# Altium schematic sheet PIC32MK.SchDoc
size B; DocumentNumber: 3; SheetNumber: 2; SheetTotal: 4
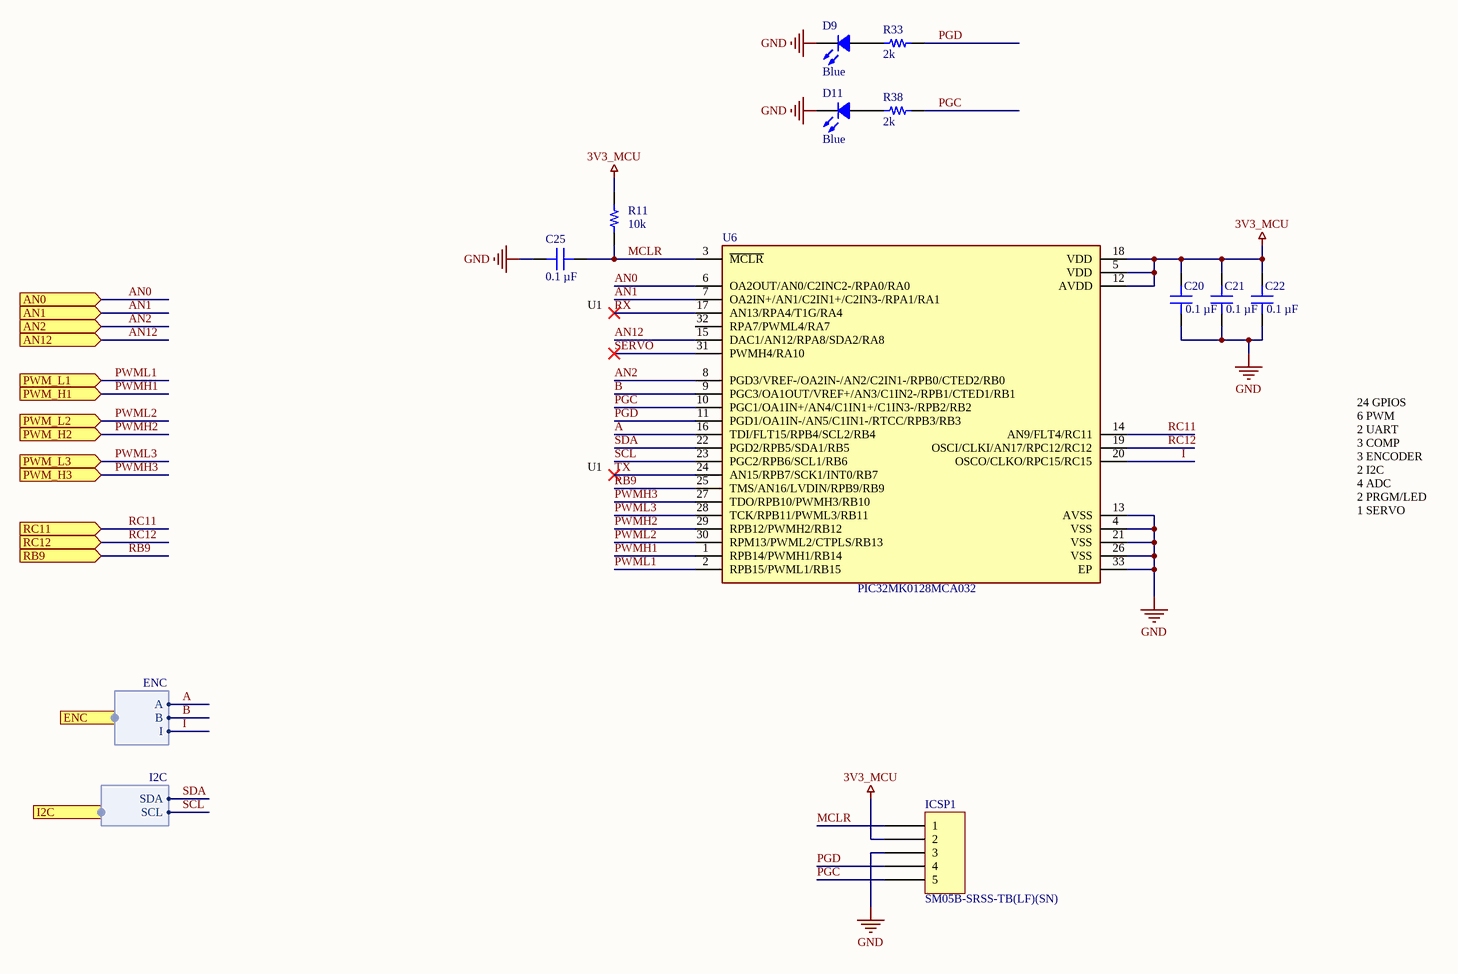
[diagram p0: PIC32MK.SchDoc]

## Parts
C20  0.1 µF  [CAP 0402_1005]
C21  0.1 µF  [CAP 0402_1005]
C22  0.1 µF  [CAP 0402_1005]
C25  0.1 µF  [CAP 0402_1005]
D9  Blue  [LED 0603_1608 GREEN]
D11  Blue  [LED 0603_1608 GREEN]
ICSP1  SM05B-SRSS-TB(LF)(SN)  [JST SM05B-SRSS-TB]
R11  10k  [RES 0402_1005]
R33  2k  [RES 0402_1005]
R38  2k  [RES 0402_1005]
U6  PIC32MK0128MCA032  [32-QFN_5x5_PIC32]

## Ports
AN0 (in), AN1 (in), AN2 (in), AN12 (in), ENC (harness ENC), I2C (harness I2C), PWM_H1 (in), PWM_H2 (in), PWM_H3 (in), PWM_L1 (in), PWM_L2 (in), PWM_L3 (in), RB9 (in), RC11 (in), RC12 (in)

## Harnesses
I2C: SDA, SCL
ENC: A, B, I

## Nets
3V3_MCU: C20.2 C21.2 C22.2 ICSP1.2 R11.2 U6.5(VDD) U6.12(AVDD) U6.18(VDD)
GND: C20.1 C21.1 C22.1 C25.2 D9.2 D11.2 ICSP1.3 U6.4(VSS) U6.13(AVSS) U6.21(VSS) U6.26(VSS) U6.33(EP)
A: U6.16(TDI/FLT15/RPB4/SCL2/RB4) ; port ENC.A
AN0: U6.6(OA2OUT/AN0/C2INC2-/RPA0/RA0) ; port AN0
AN1: U6.7(OA2IN+/AN1/C2IN1+/C2IN3-/RPA1/RA1) ; port AN1
AN2: U6.8(PGD3/VREF-/OA2IN-/AN2/C2IN1-/RPB0/CTED2/RB0) ; port AN2
AN12: U6.15(DAC1/AN12/RPA8/SDA2/RA8) ; port AN12
B: U6.9(PGC3/OA1OUT/VREF+/AN3/C1IN2-/RPB1/CTED1/RB1) ; port ENC.B
I: U6.20(OSCO/CLKO/RPC15/RC15) ; port ENC.I
MCLR: C25.1 ICSP1.1 R11.1 U6.3(~{MCLR})
PGC: ICSP1.5 R38.1 U6.10(PGC1/OA1IN+/AN4/C1IN1+/C1IN3-/RPB2/RB2)
PGD: ICSP1.4 R33.1 U6.11(PGD1/OA1IN-/AN5/C1IN1-/RTCC/RPB3/RB3)
PWMH1: U6.1(RPB14/PWMH1/RB14) ; port PWM_H1
PWMH2: U6.29(RPB12/PWMH2/RB12) ; port PWM_H2
PWMH3: U6.27(TDO/RPB10/PWMH3/RB10) ; port PWM_H3
PWML1: U6.2(RPB15/PWML1/RB15) ; port PWM_L1
PWML2: U6.30(RPM13/PWML2/CTPLS/RB13) ; port PWM_L2
PWML3: U6.28(TCK/RPB11/PWML3/RB11) ; port PWM_L3
RB9: U6.25(TMS/AN16/LVDIN/RPB9/RB9) ; port RB9
RC11: U6.14(AN9/FLT4/RC11) ; port RC11
RC12: U6.19(OSCI/CLKI/AN17/RPC12/RC12) ; port RC12
RX: U6.17(AN13/RPA4/T1G/RA4)
SCL: U6.23(PGC2/RPB6/SCL1/RB6) ; port I2C.SCL
SDA: U6.22(PGD2/RPB5/SDA1/RB5) ; port I2C.SDA
SERVO: U6.31(PWMH4/RA10)
TX: U6.24(AN15/RPB7/SCK1/INT0/RB7)
NetD9_1: D9.1 R33.2
NetD11_1: D11.1 R38.2

Not connected (* = marked no-connect by the designer): U6 32(RPA7/PWML4/RA7)

## Notes on the sheet
- (near C25) U1
- U1
- 24 GPIOS
  6 PWM
  2 UART
  3 COMP
  3 ENCODER
  2 I2C
  4 ADC
  2 PRGM/LED
  1 SERVO

## Library data of the parts
C20-C22 C25 = C0402C104K4RACAUTO: CAP CER 0.1UF 16V X7R 0402; manufacturer: KEMET; Tolerance: ±10%; Part Number: C0402C104K4RACAUTO; Value: 0.1 µF; Applications: Automotive, Bypass, Decoupling; Capacitance: 0.1 µF; componentlink1description: Datasheet; componentlink1url: https://api.kemet.com/component-edge/download/specsheet/C0402C104K4RACAUTO.pdf; componentlink2description: DigiKey Link; componentlink2url: https://www.digikey.com/en/products/detail/kemet/C0402C104K4RACAUTO/3314827; Device Package: 0402 (1005 Metric); lastupdated: 8/14/2022 9:05:51 PM; Lifecycle Status: Active; Minimum Order: 1; Mounting Type: Surface Mount, MLCC; Operating Temperature: -55°C ~ 125°C; Package / Case: 0402 (1005 Metric); packaging: TapeAndReel; partid: 3024; Part Status: Active; price: 0.01; Ratings: AEC-Q200; series: SMD Auto X7R; Size / Dimension: 0.039" L x 0.020" W (1.00mm x 0.50mm); Supplier 1: DigiKey; Supplier Part Number 1: 399-6828-1-ND; Temperature Coefficient: X7R; Thickness (Max): 0.022" (0.55mm); Voltage - Rated: 16V
D9 D11 = XZCDGK53W-8VF: Blue LED; Manufacturer: SunLED; Color: Green; Configuration: Independent; Current - Test: 2mA; Lens Color: Colorless; Lens Size: 0.35mm Dia; Lens Style: Round with Domed Top; Lens Transparency: Clear; Millicandela Rating: 417mcd; Value: Green; Viewing Angle: 60°; Voltage - Forward (Vf) (Typ): 2.65V; Wavelength - Dominant: 525nm; Wavelength - Peak: 515nm; Part Number: XZCDGK53W-8VF; ComponentLink1Description: Datasheet; ComponentLink1URL: https://www.sunledusa.com/products/spec/XZCDGK53W-8VF.pdf; ComponentLink2Description: DigiKey Link; ComponentLink2URL: http://digikey.com/product-detail/en/sunled/XZCDGK53W-8VF/1497-XZCDGK53W-8VFCT-ND/10449792; Device Package: 0603 (1608 Metric); Height (Max): 1.10mm; LastUpdated: 21-Jan-20 3:12:09 AM; Lifecycle Status: Active; Minimum Order: 1; Mounting Type: Surface Mount; Package / Case: 0603 (1608 Metric); Packaging: Unknown; PartId: 938; Part Status: Active; Price: 0.18; Series: Ultra Low Current; Size / Dimension: 1.60mm L x 0.80mm W; Supplier 1: DigiKey; Supplier Part Number 1: 1497-XZCDGK53W-8VFCT-ND; Supplier Device Package: 2-SMD
ICSP1 = SM05B-SRSS-TB(LF)(SN): CONN HEADER SMD R/A 5POS 1MM; Manufacturer: JST Sales America Inc.; Current Rating (Amps): 0.7A; Material Flammability Rating: UL94 V-0; Number of Positions: 5; Number of Positions Loaded: All; Pitch - Mating: 0.039" (1.00mm); Shrouding: Shrouded - 4 Wall; Style: Board to Cable/Wire; Voltage Rating: 50V; Part Number: SM05B-SRSS-TB(LF)(SN); ComponentLink1Description: Datasheet; ComponentLink1URL: http://www.jst-mfg.com/product/pdf/eng/eSH.pdf; ComponentLink2Description: DigiKey Link; ComponentLink2URL: http://digikey.com/product-detail/en/jst-sales-america-inc/SM05B-SRSS-TB-LF-SN/455-1805-1-ND/926876; Connector Type: Header; Contact Finish - Mating: Tin; Contact Finish - Post: Tin; Contact Material: Copper Alloy; Contact Shape: Square; Contact Type: Male Pin; Fastening Type: Push-Pull; Features: Solder Retention; Insulation Color: Natural; Insulation Height: 0.114" (2.90mm); Insulation Material: Polyamide (PA), Nylon; LastUpdated: 1/12/2020 11:42:04 PM; Lifecycle Status: Active; Minimum Order: 1; Mounting Type: Surface Mount, Right Angle; Number of Rows: 1; Operating Temperature: -25°C ~ 85°C; Packaging: TapeAndReel; PartId: 63; Part Status: Active; Price: 0.32; Series: SR; Supplier 1: DigiKey; Supplier Part Number 1: 455-1805-1-ND; Termination: Solder
R11 R33 R38 = RK73H1ETTP1432F: RES 14.3K OHM 1% 1/10W 0402; Manufacturer: KOA Speer Electronics, Inc.; Power (Watts): 0.1W, 1/10W; Resistance: 14.3 kOhms; Temperature Coefficient: ±100ppm/°C; Part Number: RK73H1ETTP1432F; ComponentLink1Description: Datasheet; ComponentLink1URL: http://www.koaspeer.com/catimages/Products/RK73H/RK73H.pdf; ComponentLink2Description: DigiKey Link; ComponentLink2URL: https://www.digikey.com/en/products/detail/koa-speer-electronics-inc/RK73H1ETTP1432F/9844351; Composition: Thick Film; Device Package: 0402 (1005 Metric); Features: Automotive AEC-Q200, Moisture Resistant; Height - Seated (Max): 0.016" (0.40mm); LastUpdated: 8/14/2022 9:23:49 PM; Lifecycle Status: Active; Minimum Order: 1; Number of Terminations: 2; Operating Temperature: -55°C ~ 155°C; Package / Case: 0402 (1005 Metric); Packaging: CutTape; PartId: 10193; Part Status: Active; Price: 0.01; Ratings: AEC-Q200; Series: RK73H; Size / Dimension: 0.039" L x 0.020" W (1.00mm x 0.50mm); Supplier 1: DigiKey; Supplier Part Number 1: 2019-RK73H1ETTP1432FCT-ND; Supplier Device Package: 0402; Tolerance: ±1%
  R11: Value: 10k
  R33 R38: Value: 2k
U6 = PIC32MK0128MCA032: PIC32MK Microcontroller IC 32-Bit 120MHz 1MB _1M x 8_ FLASH 32-VQFN_5x5_; MP: PIC32MK1024MCF064-I/PT; MF: Microchip; Digi-Key_Purchase_URL: https://www.digikey.kr/product-detail/en/microchip-technology/PIC32MK1024MCF064-I-PT/PIC32MK1024MCF064-I-PT-ND/7164902?utm_source=snapeda&utm_medium=aggregator&utm_campaign=symbol; Package: TQFP-64 Microchip; Digi-Key_Part_Number: PIC32MK1024MCF064-I/PT-ND; Value: *; SnapEDA_Link: https://www.snapeda.com/parts/PIC32MK1024MCF064-I/PT/Microchip/view-part/876704/?ref=snap